# Altium schematic sheet frontbreakoutSchematic.SchDoc
size A; SheetNumber: 1; SheetTotal: 5
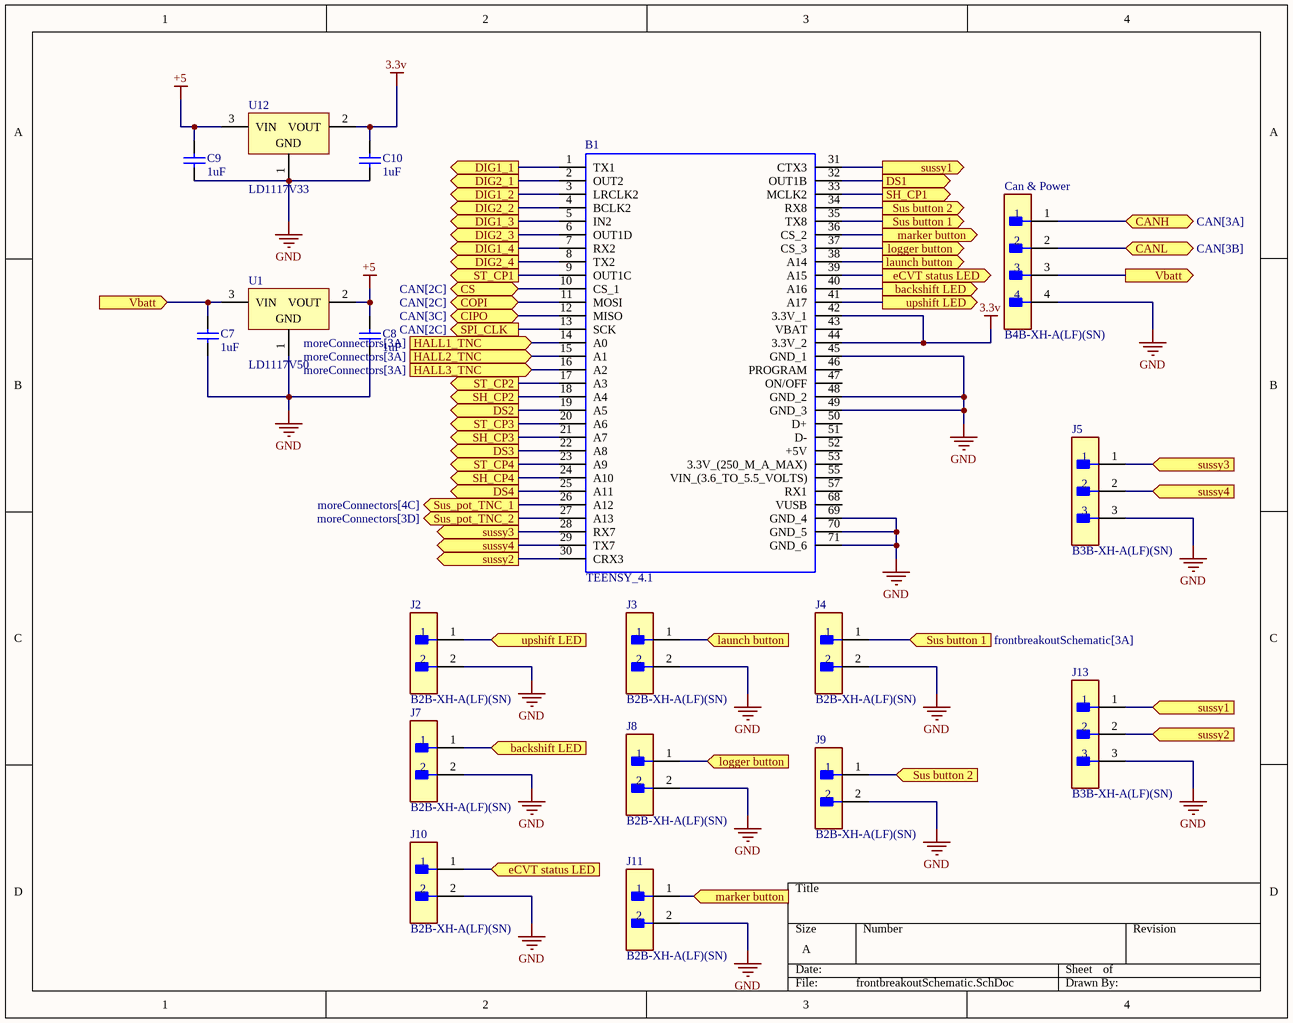
[diagram p0: frontbreakoutSchematic.SchDoc]

## Parts
B1  TEENSY_4.1  [TEENSY41]
C7  1uF  [CAPC2013X145X50LL20T25]
C8  1uF  [CAPC2013X145X50LL20T25]
C9  1uF  [CAPC2013X145X50LL20T25]
C10  1uF  [CAPC2013X145X50LL20T25]
Can_&_Power  B4B-XH-A(LF)(SN)  [FP-B4B-XH-A_LF_SN-MFG]
J2  B2B-XH-A(LF)(SN)  [FP-B2B-XH-A_LF_SN-MFG]
J3  B2B-XH-A(LF)(SN)  [FP-B2B-XH-A_LF_SN-MFG]
J4  B2B-XH-A(LF)(SN)  [FP-B2B-XH-A_LF_SN-MFG]
J5  B3B-XH-A(LF)(SN)  [FP-B3B-XH-A_LF_SN-MFG]
J7  B2B-XH-A(LF)(SN)  [FP-B2B-XH-A_LF_SN-MFG]
J8  B2B-XH-A(LF)(SN)  [FP-B2B-XH-A_LF_SN-MFG]
J9  B2B-XH-A(LF)(SN)  [FP-B2B-XH-A_LF_SN-MFG]
J10  B2B-XH-A(LF)(SN)  [FP-B2B-XH-A_LF_SN-MFG]
J11  B2B-XH-A(LF)(SN)  [FP-B2B-XH-A_LF_SN-MFG]
J13  B3B-XH-A(LF)(SN)  [FP-B3B-XH-A_LF_SN-MFG]
U1  LD1117V50  [TO220]
U12  LD1117V33  [TO220]

## Ports
backshift LED (in, see frontbreakoutSchematic[3B]), backshift LED (out, see frontbreakoutSchematic[2C]), CANH (bidir, see CAN[3A]), CANL (bidir, see CAN[3B]), CIPO (bidir, see CAN[3C]), COPI (bidir, see CAN[2C]), CS (bidir, see CAN[2C]), DIG1_1 (out, see SEX[3A]), DIG1_2 (out, see SEX[3C]), DIG1_3 (out, see SEX[2B]), DIG1_4 (out, see SEX[3C]), DIG2_1 (out, see SEX[1A]), DIG2_2 (out, see SEX[1C]), DIG2_3 (out, see SEX[1B]), DIG2_4 (out, see SEX[1C]), DS1 (out, see ssegs_and_registers[1A]), DS2 (out, see ssegs_and_registers[1C]), DS3 (out, see ssegs_and_registers[3A]), DS4 (out, see ssegs_and_registers[3C]), eCVT status LED (in, see frontbreakoutSchematic[3B]), eCVT status LED (out, see frontbreakoutSchematic[2D]), HALL1_TNC (in, see moreConnectors[3A]), HALL2_TNC (in, see moreConnectors[3A]), HALL3_TNC (in, see moreConnectors[3A]), launch button (in, see frontbreakoutSchematic[3B]), launch button (out, see frontbreakoutSchematic[3C]), logger button (in, see frontbreakoutSchematic[3A]), logger button (out, see frontbreakoutSchematic[3C]), marker button (in, see frontbreakoutSchematic[3A]), marker button (out, see frontbreakoutSchematic[3D]), SH_CP1 (out, see ssegs_and_registers[1A]), SH_CP2 (out, see ssegs_and_registers[1C]), SH_CP3 (out, see ssegs_and_registers[3A]), SH_CP4 (out, see ssegs_and_registers[3C]), SPI_CLK (out, see CAN[2C]), ST_CP1 (out, see ssegs_and_registers[1A]), ST_CP2 (out, see ssegs_and_registers[1B]), ST_CP3 (out, see ssegs_and_registers[3A]), ST_CP4 (out, see ssegs_and_registers[3B]), Sus button 1 (in, see frontbreakoutSchematic[3A]), Sus button 1 (out, see frontbreakoutSchematic[3C]), Sus button 2 (in, see frontbreakoutSchematic[3A]), Sus button 2 (out, see frontbreakoutSchematic[3D]), Sus_pot_TNC_1 (out, see moreConnectors[4C]), Sus_pot_TNC_2 (out, see moreConnectors[3D]), sussy1 (in, see frontbreakoutSchematic[3A]), sussy1 (out, see frontbreakoutSchematic[4C]), sussy2 (in, see frontbreakoutSchematic[2C]), sussy2 (out, see frontbreakoutSchematic[4C]), sussy3 (in, see frontbreakoutSchematic[2C]), sussy3 (out, see frontbreakoutSchematic[4B]), sussy4 (in, see frontbreakoutSchematic[2C]), sussy4 (out, see frontbreakoutSchematic[4B]), upshift LED (in, see frontbreakoutSchematic[3B]), upshift LED (out, see frontbreakoutSchematic[2C]), Vbatt (in, see frontbreakoutSchematic[4B], moreConnectors[1A], moreConnectors[2B], moreConnectors[3A]), Vbatt (out, see frontbreakoutSchematic[1B], moreConnectors[1A], moreConnectors[2B], moreConnectors[3A])

## Nets
3.3v: B1.42(3.3V_1) B1.44(3.3V_2) C10.2 U12.2(VOUT)
+5: C8.2 C9.2 U1.2(VOUT) U12.3(VIN)
GND: B1.45(GND_1) B1.48(GND_2) B1.49(GND_3) B1.69(GND_4) B1.70(GND_5) B1.71(GND_6) C7.1 C8.1 C9.1 C10.1 Can_&_Power.4 J2.2 J3.2 J4.2 J5.3 J7.2 J8.2 J9.2 J10.2 J11.2 J13.3 U1.1(GND) U12.1(GND)
backshift LED: B1.40(A16) J7.1 ; port backshift LED
CANH: Can_&_Power.1 ; port CANH
CANL: Can_&_Power.2 ; port CANL
CIPO: B1.12(MISO) ; port CIPO
COPI: B1.11(MOSI) ; port COPI
CS: B1.10(CS_1) ; port CS
DIG1_1: B1.1(TX1) ; port DIG1_1
DIG1_2: B1.3(LRCLK2) ; port DIG1_2
DIG1_3: B1.5(IN2) ; port DIG1_3
DIG1_4: B1.7(RX2) ; port DIG1_4
DIG2_1: B1.2(OUT2) ; port DIG2_1
DIG2_2: B1.4(BCLK2) ; port DIG2_2
DIG2_3: B1.6(OUT1D) ; port DIG2_3
DIG2_4: B1.8(TX2) ; port DIG2_4
DS1: B1.32(OUT1B) ; port DS1
DS2: B1.19(A5) ; port DS2
DS3: B1.22(A8) ; port DS3
DS4: B1.25(A11) ; port DS4
eCVT status LED: B1.39(A15) J10.1 ; port eCVT status LED
HALL1_TNC: B1.14(A0) ; port HALL1_TNC
HALL2_TNC: B1.15(A1) ; port HALL2_TNC
HALL3_TNC: B1.16(A2) ; port HALL3_TNC
launch button: B1.38(A14) J3.1 ; port launch button
logger button: B1.37(CS_3) J8.1 ; port logger button
marker button: B1.36(CS_2) J11.1 ; port marker button
SH_CP1: B1.33(MCLK2) ; port SH_CP1
SH_CP2: B1.18(A4) ; port SH_CP2
SH_CP3: B1.21(A7) ; port SH_CP3
SH_CP4: B1.24(A10) ; port SH_CP4
SPI_CLK: B1.13(SCK) ; port SPI_CLK
ST_CP1: B1.9(OUT1C) ; port ST_CP1
ST_CP2: B1.17(A3) ; port ST_CP2
ST_CP3: B1.20(A6) ; port ST_CP3
ST_CP4: B1.23(A9) ; port ST_CP4
Sus button 1: B1.35(TX8) J4.1 ; port Sus button 1
Sus button 2: B1.34(RX8) J9.1 ; port Sus button 2
Sus_pot_TNC_1: B1.26(A12) ; port Sus_pot_TNC_1
Sus_pot_TNC_2: B1.27(A13) ; port Sus_pot_TNC_2
sussy1: B1.31(CTX3) J13.1 ; port sussy1
sussy2: B1.30(CRX3) J13.2 ; port sussy2
sussy3: B1.28(RX7) J5.1 ; port sussy3
sussy4: B1.29(TX7) J5.2 ; port sussy4
upshift LED: B1.41(A17) J2.1 ; port upshift LED
Vbatt: C7.2 Can_&_Power.3 U1.3(VIN) ; port Vbatt

Not connected (* = marked no-connect by the designer): B1 43(VBAT) 46(PROGRAM) 47(ON/OFF) 50(D+) 51(D-) 52(+5V) 53(3.3V_(250_M_A_MAX)) 55(VIN_(3.6_TO_5.5_VOLTS)) 57(RX1) 68(VUSB)

## Library data of the parts
B1 = TEENSY_4.1: Teensy 4.1 Development Board; Manufacturer_Name: PJRC; Manufacturer_Part_Number: TEENSY 4.1; Mouser Part Number: *; Mouser Price/Stock: *; Arrow Part Number: *; Arrow Price/Stock: *; Mouser Testing Part Number: *; Mouser Testing Price/Stock: *; Datasheet Link: https://www.pjrc.com/store/teensy41.html
C7-C10 = CMP-1036-04746-2: C0805C105K4PACTU; Manufacturer: Kemet; Part Number: C0805C105K4PACTU
Can_&_Power = CMP-17439-000250-1: CONN HEADER VERT 4POS 2.5MM; Number of Contacts: 4; Contact Resistance: 20mR; Voltage Rating: 250V; Max Current Rating: 3A; Gender: Male; Wire/Cable Gauge: 22AWG; Mated Stacking Heights: 9.8mm; Insulation Resistance: 1GR; Orientation: Straight; Contact Type: Male Pin; Contact Finish - Mating: TIN; Series: XH; Max Voltage Rating (AC): 250V; Lead Pitch: 2.5mm; Contact Shape: Square; Insulation Color: Natural; Termination: Solder; Lead Free: Lead Free; Voltage Rating (AC): 250V; Number of Rows: 1; Flammability Rating: UL94 V-0; Number of Positions: 4; Max Operating Temperature: 85°C; Package Quantity: 500; Mount: Through Hole; REACH SVHC: No SVHC; Connector Type: Header; Insulation Material: Nylon; Fastening Type: Detent; Min Operating Temperature: -25°C; Housing Color: White; Packaging: Bulk; Contact Plating: Tin; Contact Material: Brass; Max Voltage Rating (DC): 250V; Housing Material: Polyamide; Color: Natural; Material: Polyamide; Pitch: 2.5mm; Depth: 5.75mm; Current Rating: 3A; Length: 12.4mm
J2-J4 J7-J11 = CMP-2000-05888-3: CONN HEADER VERT 2POS 2.5MM; Current Rating: 3A; Voltage Rating: 250V; Number of Contacts: 2; Contact Resistance: 20mR; Wire/Cable Gauge: 22AWG; Insulation Resistance: 1GR; Connector Type: Male Pin; Packaging: Bulk; Contact Material: Brass; Lead Free: Lead Free; Orientation: Straight; Contact Plating: Tin; Max Current Rating: 3A; Termination: Solder; Fastening Type: Detent; Depth: 5.75mm; Housing Material: Polyamide; REACH SVHC: No SVHC; Series: XH; Voltage Rating (AC): 250V; Number of Positions: 2; Color: Natural; Contact Type: Male Pin; Max Voltage Rating (DC): 250V; Pitch: 2.5mm; Lead Pitch: 2.5mm; Mount: Through Hole; Max Operating Temperature: 85°C; Length: 7.4mm; Max Voltage Rating (AC): 250V; Min Operating Temperature: -25°C; Number of Rows: 1; Housing Color: White
J5 J13 = CMP-17439-000014-3: CONN HEADER VERT 3POS 2.5MM; Max Voltage Rating (DC): 250V; Number of Positions: 3; Current Rating: 3A; Gender: Male; Wire/Cable Gauge: 22AWG; Contact Resistance: 20mR; Insulation Resistance: 1GR; Insulation Material: Nylon; Contact Plating: Tin; Depth: 5.75mm; Contact Type: Male Pin; Max Operating Temperature: 85°C; Insulation Color: Natural; Voltage Rating (AC): 250V; Color: Natural; Connector Type: Header; Orientation: Straight; Fastening Type: Detent; Housing Color: White; Min Operating Temperature: -25°C; Termination: Solder; Voltage Rating: 250V; Series: XH; Pitch: 2.5mm; Contact Shape: Square; Number of Rows: 1; Lead Free: Lead Free; Packaging: Bulk; Mount: Through Hole; Flammability Rating: UL94 V-0; Max Voltage Rating (AC): 250V; REACH SVHC: No SVHC; Housing Material: Polyamide; Contact Material: Brass; Lead Pitch: 2.5mm; Contact Finish - Mating: TIN; Length: 9.9mm; Max Current Rating: 3A; Number of Contacts: 3
U1 = CMP-0244-00472-1: Fixed Low Drop Positive Voltage Regulator, 5V, 3-Pin TO-220; ComponentLink1URL: http://www.st.com; ComponentLink1Description: Manufacturer URL; DatasheetVersion: 1/11/2011; PackageDescription: TO, Thru-Hole, Vertical, Heatsink Mounted; 3 In-Line Leads; Pitch 2.54 mm; ComponentLink2Description: Datasheet; ComponentLink3URL: http://www.st.com/internet/com/TECHNICAL_RESOURCES/TECHNICAL_LITERATURE/PACKAGE_INFORMATION/CD00004649.pdf; PackageVersion: ver3.0; PackageReference: TO220; ComponentLink2URL: http://www.st.com/internet/com/TECHNICAL_RESOURCES/TECHNICAL_LITERATURE/DATASHEET/CD00000544.pdf; ComponentLink3Description: Package Specification
U12 = CMP-0244-00470-1: Fixed Low Drop Positive Voltage Regulator, 3.3V, 3-Pin TO-220; PackageVersion: ver3.0; PackageDescription: TO, Thru-Hole, Vertical, Heatsink Mounted; 3 In-Line Leads; Pitch 2.54 mm; ComponentLink1Description: Manufacturer URL; ComponentLink3URL: http://www.st.com/internet/com/TECHNICAL_RESOURCES/TECHNICAL_LITERATURE/PACKAGE_INFORMATION/CD00004649.pdf; PackageReference: TO220; ComponentLink2URL: http://www.st.com/internet/com/TECHNICAL_RESOURCES/TECHNICAL_LITERATURE/DATASHEET/CD00000544.pdf; ComponentLink3Description: Package Specification; ComponentLink2Description: Datasheet; ComponentLink1URL: http://www.st.com; DatasheetVersion: 1/11/2011